# Altium schematic sheet SensorLTR390.SchDoc
size A4; Engineer: Kayann Soares; SheetNumber: 5; SheetTotal: 10; CompanyInfo1: Universidade Federal do Ceará; CompanyInfo2: Centro de Tecnologia - CT; CompanyInfo3: Dep. de Eng. de Teleinformática
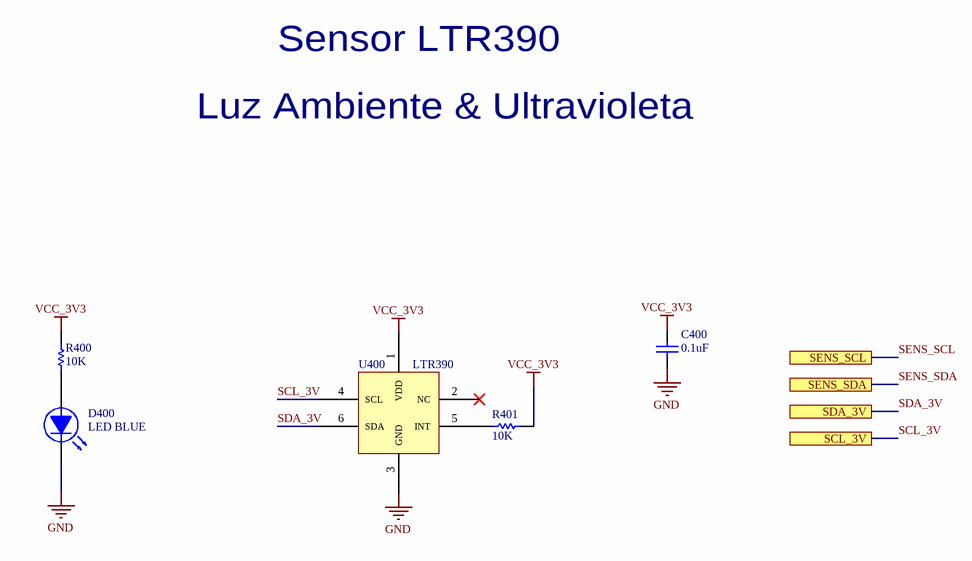
[diagram p0: SensorLTR390.SchDoc]

## Parts
C400  0.1uF  [CAP_CER_0603]
D400  LED BLUE  [LED_BLUE_SMD_0603]
R400  10K  [RES_0603]
R401  10K  [RES_0603]
U400  LTR390  [LTR390]

## Ports
SCL_3V, SDA_3V, SENS_SCL, SENS_SDA

## Nets
GND: C400.1 D400.K U400.3(GND)
VCC_3V3: C400.2 R400.2 R401.2 U400.1(VDD)
SCL_3V: U400.4(SCL) ; port SCL_3V
SDA_3V: U400.6(SDA) ; port SDA_3V
SENS_SCL: port SENS_SCL
SENS_SDA: port SENS_SDA
NetD400_A: D400.A R400.1
NetR401_1: R401.1 U400.5(INT)

Not connected (* = marked no-connect by the designer): U400 2(NC)*

## Notes on the sheet
- Sensor LTR390
- Luz Ambiente & Ultravioleta
- Título:
- Padrão:
- Projeto:
- Eng. Responsável:
- A4
- Data:
- Versão:
- Folha:
- V1
- de
- Arquivo:

## Library data of the parts
C400 = CAP_CER_0.1uF_0603: Supplier 1: Digi-Key Marketplace; Supplier Part Number 1: 2571-GMC10X7R104J25NTTR-ND
D400 = LED_BLUE_SMD_0603: ComponentLink1Description: New link; ComponentLink1URL: *; Supplier 1: Digi-Key; Supplier Part Number 1: 754-1434-1-ND
R400 R401 = RES_10K_0603: Supplier 1: Digi-Key Marketplace; Supplier Part Number 1: 2571-RM06J103CTTR-ND
U400 = LTR390: Supplier 1: Digi-Key; Supplier Part Number 1: LTR-390UV-01-ND